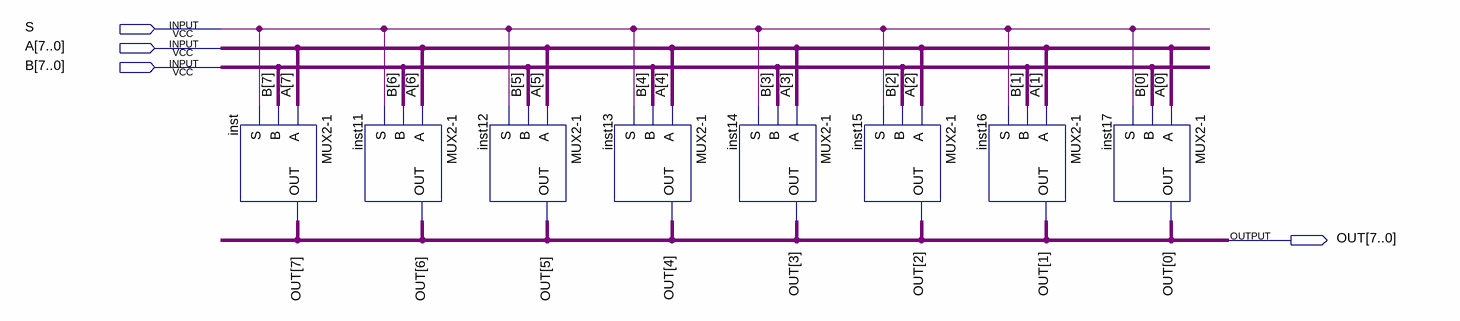
[diagram p0: schematic sheet]
// Quartus schematic MUX2-1_8bit.bdf as structural Verilog: 8 symbols, 4 pins
module \MUX2-1_8bit  (
  input  S,
  input  [7:0] A,
  input  [7:0] B,
  output [7:0] OUT
);

  \MUX2-1  inst (.A(A[7]), .B(B[7]), .S(S), .OUT(OUT[7]));
  \MUX2-1  inst11 (.A(A[6]), .B(B[6]), .S(S), .OUT(OUT[6]));
  \MUX2-1  inst12 (.A(A[5]), .B(B[5]), .S(S), .OUT(OUT[5]));
  \MUX2-1  inst13 (.A(A[4]), .B(B[4]), .S(S), .OUT(OUT[4]));
  \MUX2-1  inst14 (.A(A[3]), .B(B[3]), .S(S), .OUT(OUT[3]));
  \MUX2-1  inst15 (.A(A[2]), .B(B[2]), .S(S), .OUT(OUT[2]));
  \MUX2-1  inst16 (.A(A[1]), .B(B[1]), .S(S), .OUT(OUT[1]));
  \MUX2-1  inst17 (.A(A[0]), .B(B[0]), .S(S), .OUT(OUT[0]));
endmodule
